# EAGLE design V2_Layout (EAGLE 9.2.2)
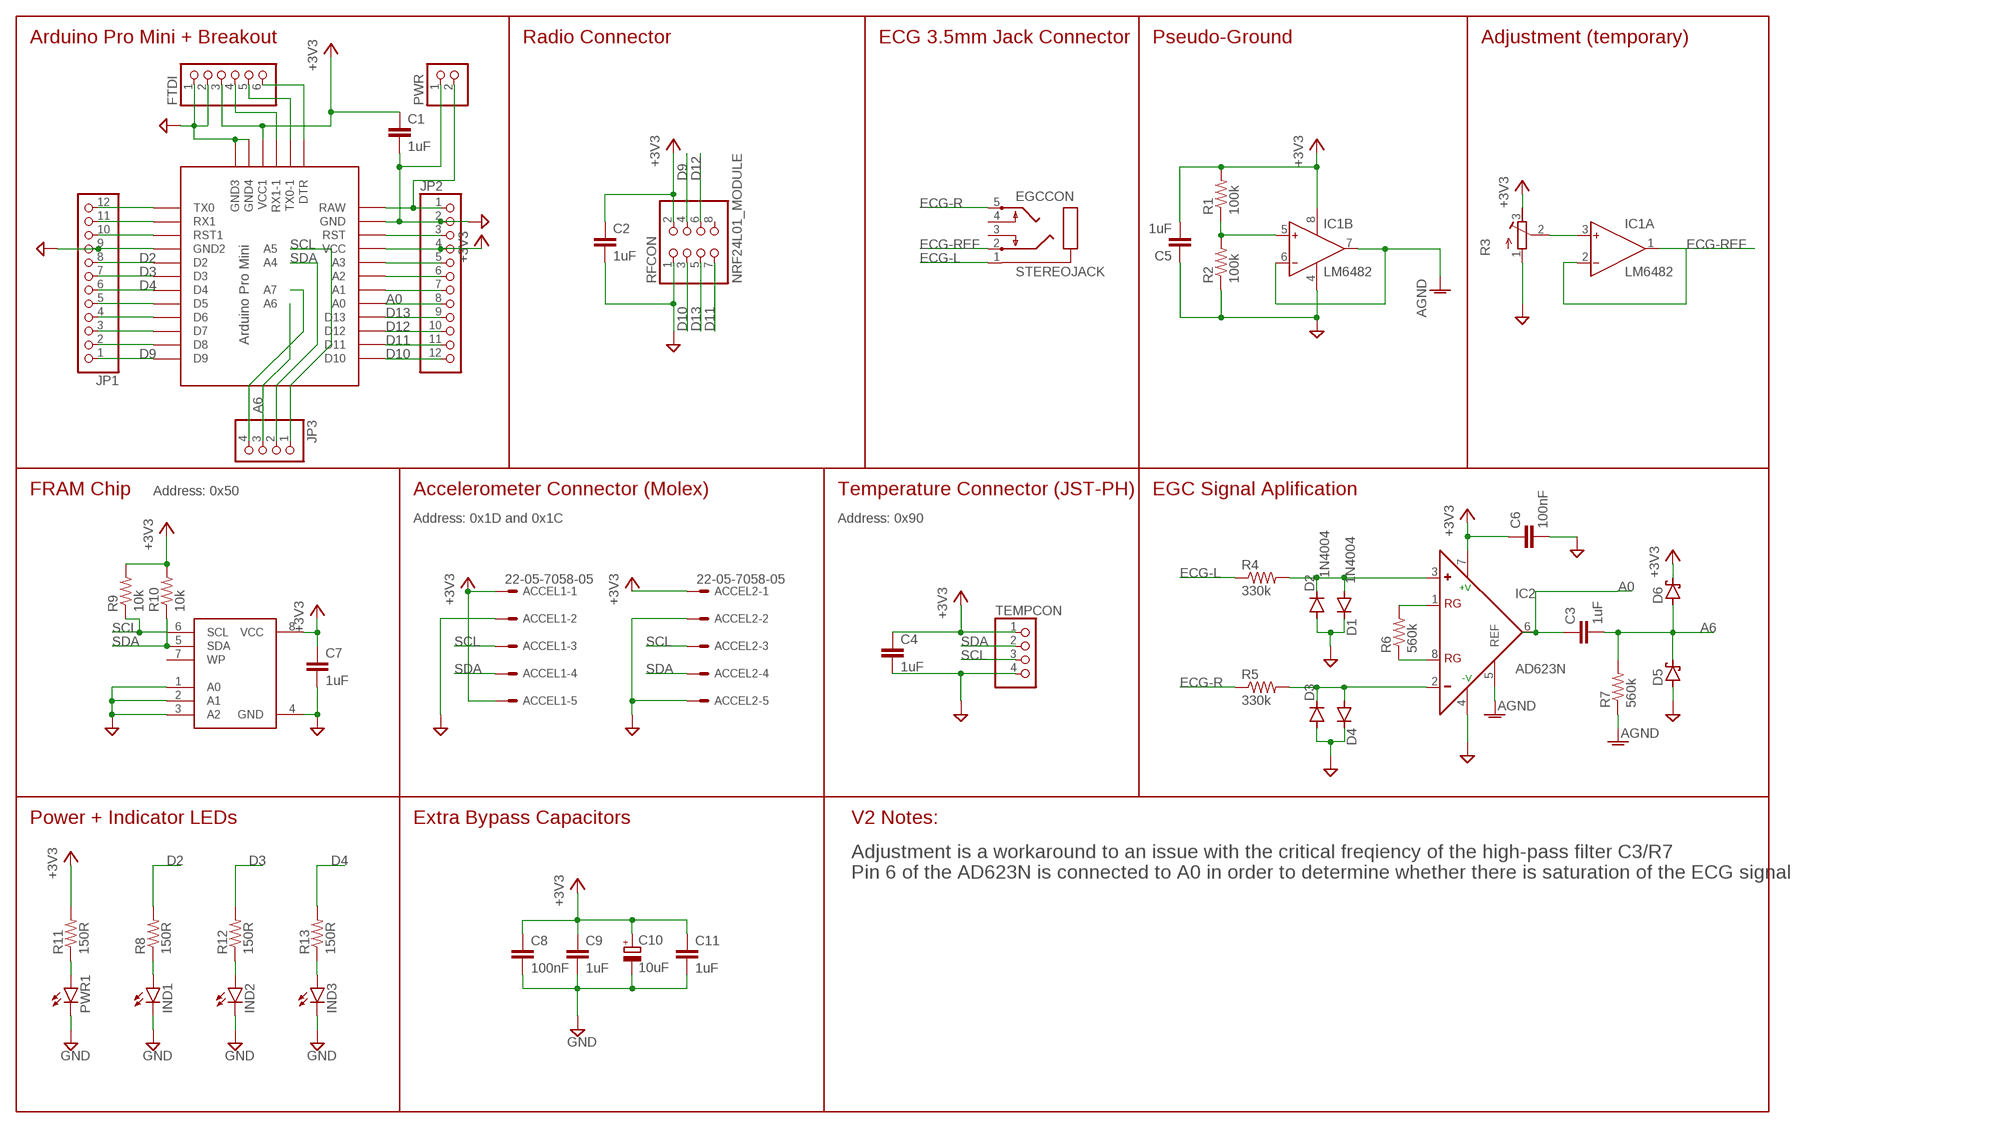
[diagram p0: schematic, sheet 1]

## Parts
ACCEL1  22-05-7058-05  [7395-05]
ACCEL2  22-05-7058-05  [7395-05]
C1  1uF  C-EUC0603  [C0603]
C2  1uF  C-EUC0603  [C0603]
C3  1uF  C-EUC0603  [C0603]
C4  1uF  C-EUC0603  [C0603]
C5  1uF  C-EUC0603  [C0603]
C6  100nF  C-EUC0603  [C0603]
C7  1uF  C-EUC0603  [C0603]
C8  100nF  C-EU025-030X050  [C025-030X050]
C9  1uF  C-EU025-030X050  [C025-030X050]
C10  10uF  CPOL-EUTAP5-45  [TAP5-45]
C11  1uF  C-EU025-030X050  [C025-030X050]
D1  1N4004  [DO41-10]
D2  1N4004  [DO41-10]
D3  1N4004  [DO41-10]
D4  1N4004  [DO41-10]
D5  SCHOTTKY-DIODEDO35-7  [DO35-7]
D6  SCHOTTKY-DIODEDO35-7  [DO35-7]
EGCCON  STEREOJACK  [STX3100]
FTDI  PINHD-1X6  [1X06]
IC1  LM6482  AD826N  [DIL08]
IC2  AD623N  [DIL08]
IND1  LEDCHIPLED_0805  [CHIPLED_0805]
IND2  LEDCHIPLED_0805  [CHIPLED_0805]
IND3  LEDCHIPLED_0805  [CHIPLED_0805]
JP1  PINHD-1X12  [1X12]
JP2  PINHD-1X12  [1X12]
JP3  PINHD-1X4  [1X04]
PWR  PINHD-1X2  [1X02]
PWR1  LEDCHIPLED_0805  [CHIPLED_0805]
R1  100k  R-US_R0603  [R0603]
R2  100k  R-US_R0603  [R0603]
R3  R-TRIMM64P  [RTRIM64P]
R4  330k  R-US_R0603  [R0603]
R5  330k  R-US_R0603  [R0603]
R6  560k  R-US_R0603  [R0603]
R7  560k  R-US_R0603  [R0603]
R8  150R  R-US_R0603  [R0603]
R9  10k  R-US_R0603  [R0603]
R10  10k  R-US_R0603  [R0603]
R11  150R  R-US_R0603  [R0603]
R12  150R  R-US_R0603  [R0603]
R13  150R  R-US_R0603  [R0603]
RFCON  NRF24L01_MODULE  [2X04]
TEMPCON  PINHD-1X4M  [1X04M]
U2  MB85RC256VPF-G-JNERE2  [SOIC8]
U$1  PRO-MINI-2  [PRO-MINI-2]

## Nets
+3V3 [POWER]: ACCEL1.1 ACCEL1.5 ACCEL2.1 C1.1 C2.1 C4.1 C5.2 C6.1 C7.1 C8.1 C9.1 C10.+ C11.1 D6.C FTDI.3 IC1.8(P:V+) IC2.7(+V) JP2.4 R1.2 R3.3(E) R9.2 R10.2 R11.2 RFCON.2 TEMPCON.1 U2.8(VCC) U$1.VCC U$1.VCC1
A0: C3.1 IC2.6(OUT) JP2.8 U$1.A3(A0)
A6: C3.2 D5.C D6.A JP3.3 R7.2 U$1.A6
AGND: IC1.6(B:IN-) IC1.7(B:OUT) IC2.5(REF) R7.1
D2: JP1.8 R8.2 U$1.D2
D3: JP1.7 R12.2 U$1.D3
D4: JP1.6 R13.2 U$1.D4
D5: JP1.5 U$1.D5
D6: JP1.4 U$1.D6
D7: JP1.3 U$1.D7
D8: JP1.2 U$1.D8
D9: JP1.1 RFCON.4 U$1.D9
D10: JP2.12 RFCON.3 U$1.D10
D11: JP2.11 RFCON.7 U$1.D11
D12: JP2.10 RFCON.6 U$1.D12
D13: JP2.9 RFCON.5 U$1.D13
ECG-L: EGCCON.1 R4.1
ECG-R: EGCCON.5 R5.1
ECG-REF: EGCCON.2 IC1.1(A:OUT) IC1.2(A:IN-)
GND [POWER]: ACCEL1.2 ACCEL2.2 ACCEL2.5 C1.2 C2.2 C4.2 C5.1 C6.2 C7.2 C8.2 C9.2 C10.- C11.2 D1.C D2.A D3.A D4.C D5.A FTDI.1 FTDI.2 IC1.4(P:V-) IC2.4(-V) IND1.C IND2.C IND3.C JP1.9 JP2.2 PWR1.C PWR.1 R2.1 R3.1(A) RFCON.1 TEMPCON.4 U2.1(A0) U2.2(A1) U2.3(A2) U2.4(GND) U$1.GND U$1.GND1(GND2) U$1.GND2(GND3) U$1.GND3(GND4)
N$1: PWR1.A R11.1
N$2: D3.C D4.A IC2.2(-) R5.2
N$3: IC1.5(B:IN+) R1.1 R2.2
N$4: FTDI.4 U$1.RX1-1
N$5: D1.A D2.C IC2.3(+) R4.2
N$7: IC2.8(RG) R6.1
N$8: IC2.1(RG) R6.2
N$9: JP1.12 U$1.TX0
N$10: JP1.11 U$1.RX1
N$11: JP1.10 U$1.RST1
N$12: FTDI.5 U$1.TX0-1
N$13: FTDI.6 U$1.DTR
N$14: IND1.A R8.1
N$15: IND2.A R12.1
N$16: IND3.A R13.1
N$17: IC1.3(A:IN+) R3.2(S)
N$21: JP2.1 PWR.2 U$1.RAW
N$23: JP2.3 U$1.RST
N$24: JP2.5 U$1.A0(A3)
N$25: JP2.6 U$1.A1(A2)
N$26: JP2.7 U$1.A2(A1)
N$28: JP3.4 U$1.A7
SCL: ACCEL1.3 ACCEL2.3 JP3.1 R9.1 TEMPCON.3 U2.6(SCL) U$1.A5
SDA: ACCEL1.4 ACCEL2.4 JP3.2 R10.1 TEMPCON.2 U2.5(SDA) U$1.A4
Unconnected: EGCCON.3 EGCCON.4 RFCON.8 U2.7(WP)

## Notes on the sheet
- Arduino Pro Mini + Breakout | Radio Connector | ECG 3.5mm Jack Connector | Pseudo-Ground | Adjustment (temporary)
- FRAM Chip | Address: 0x50 | Accelerometer Connector (Molex) | Temperature Connector (JST-PH) | EGC Signal Aplification
- Address: 0x1D and 0x1C | Address: 0x90
- Power + Indicator LEDs | Extra Bypass Capacitors | V2 Notes:
- Adjustment is a workaround to an issue with the critical freqiency of the high-pass filter C3/R7
  Pin 6 of the AD623N is connected to A0 in order to determine whether there is saturation of the ECG signal

## Library data of the parts
ACCEL1 ACCEL2 = con-molex:22-?-05: CONNECTOR wire to board 2.54 mm (.1 inch) pitch header; MF: MOLEX; OC_FARNELL: unknown; OC_NEWARK: unknown
C1-C9 C11 = rcl:C-EU: CAPACITOR, European symbol; SPICEPREFIX: C
C10 = rcl:CPOL-EU: POLARIZED CAPACITOR, European symbol; SPICEPREFIX: C
D1-D4 = diode:1N4004: DIODE general purpose rectifier, 1 A
D5 D6 = diode:SCHOTTKY-DIODE: Schottky Diode
EGCCON = adafruit:STEREOJACK: MIC/HEADPHONE JACK Stereo jack with two switches. Kycon STX3100, CUI SJ1-3555NG and/or 4UCon 05544
FTDI = pinhead:PINHD-1X6: PIN HEADER
IC1 = analog-devices:AD826: High-Speed, Low-Power Dual Operational Amplifier Source: http://www.analog.com/static/imported-files/data_sheets/AD826.pdf; MF: ALTERA CORPORATION; MPN: AD826ANZ; OC_FARNELL: 1438583; OC_NEWARK: 59K6530
IC2 = analog-devices:AD623: Single-Supply, Rail-to-Rail, Low Cost Instrumentation Amplifier Source: http://www.analog.com/static/imported-files/data_sheets/AD623.pdf; MF: ALTERA CORPORATION; MPN: AD623ANZ; OC_FARNELL: 9603700; OC_NEWARK: 59K4402
IND1-IND3 PWR1 = led:LED: LED OSRAM: - CHIPLED LG R971, LG N971, LY N971, LG Q971, LY Q971, LO R971, LY R971 LH N974, LH R974 LS Q976, LO Q976, LY Q976 LO Q996 - Hyper CHIPLED LW Q18S LB Q993, LB Q99A, LB R99A - SideLED LS A670, LO A670, LY A670, LG A670, LP A670 LB A673, LV A673, LT A673, LW A673 LH A674 LY A675 LS A676, LA A676, LO A676, LY A676, LW A676 LS A679, LY A679, LG A679 - Hyper Micro SIDELED® LS Y876, LA Y876, LO Y876, LY Y876 LT Y87S - SmartLED LW L88C, LW L88S LB L89C, LB L89S, LG L890 LS L89K, LO L89K, LY L89K LS L896, LA L896, LO L896, LY L896 - TOPLED LS T670, LO T670, LY T670, LG T670, LP T670 LSG T670, LSP T670, LSY T670, LOP T670, LYG T670 LG T671, LOG T671, LSG T671 LB T673, LV T673, LT T673, LW T673 LH T674 LS T676, LA T676, LO T676, LY T676, LB T676, LH T676, LSB T676, LW T676 LB T67C, LV T67C, LT T67C, LS T67K, LO T67K, LY T67K, LW E67C LS E67B, LA E67B, LO E67B, LY E67B, LB E67C, LV E67C, LT E67C LW T67C LS T679, LY T679, LG T679 LS T770, LO T770, LY T770, LG T770, LP T770 LB T773, LV T773, LT T773, LW T773 LH T774 LS E675, LA E675, LY E675, LS T675 LS T776, LA T776, LO T776, LY T776, LB T776 LHGB T686 LT T68C, LB T68C - Hyper Mini TOPLED® LB M676 - Mini TOPLED Santana® LG M470 LS M47K, LO M47K, LY M47K Source: http://www.osram.convergy.de LUXEON: - LUMILED® LXK2-PW12-R00, LXK2-PW12-S00, LXK2-PW14-U00, LXK2-PW14-V00 LXK2-PM12-R00, LXK2-PM12-S00, LXK2-PM14-U00 LXK2-PE12-Q00, LXK2-PE12-R00, LXK2-PE12-S00, LXK2-PE14-T00, LXK2-PE14-U00 LXK2-PB12-K00, LXK2-PB12-L00, LXK2-PB12-M00, LXK2-PB14-N00, LXK2-PB14-P00, LXK2-PB14-Q00 LXK2-PR12-L00, LXK2-PR12-M00, LXK2-PR14-Q00, LXK2-PR14-R00 LXK2-PD12-Q00, LXK2-PD12-R00, LXK2-PD12-S00 LXK2-PH12-R00, LXK2-PH12-S00 LXK2-PL12-P00, LXK2-PL12-Q00, LXK2-PL12-R00 Source: www.luxeon.com KINGBRIGHT: KA-3528ASYC Source: www.kingbright.com
JP1 JP2 = pinhead:PINHD-1X12: PIN HEADER
JP3 = pinhead:PINHD-1X4: PIN HEADER
PWR = pinhead:PINHD-1X2: PIN HEADER
R1 R2 R4-R13 = rcl:R-US_: RESISTOR, American symbol; SPICEPREFIX: R
R3 = rcl:R-TRIMM: Trimm resistor; SPICEMODEL: X; SPICEPREFIXL: POT
RFCON = Custom Parts:NRF24L01_MODULE
TEMPCON = pinhead2:PINHD-1X4: PIN HEADER
U2 = Custom Parts:MB85RC256VPF-G-JNERE2
U$1 = Arduino-clone:PRO-MINI-2: Arduino Pro Mini Layout 2 Sparkfun.com

## Net classes
0 default: width 0.406 mm
1 POWER: width 0.61 mm

## Board
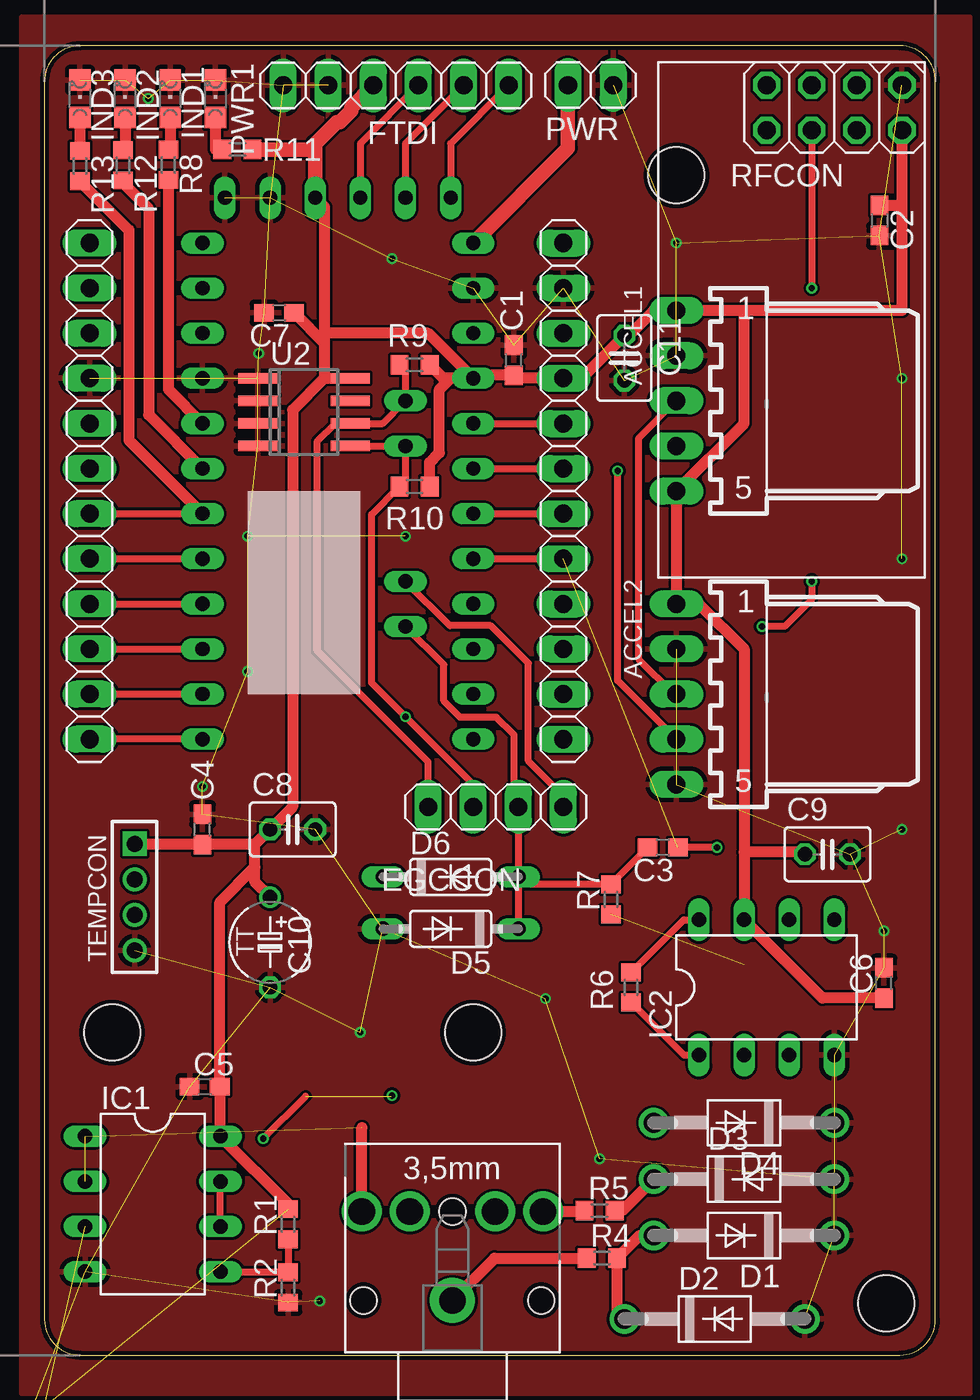
[diagram p1: board, top side]
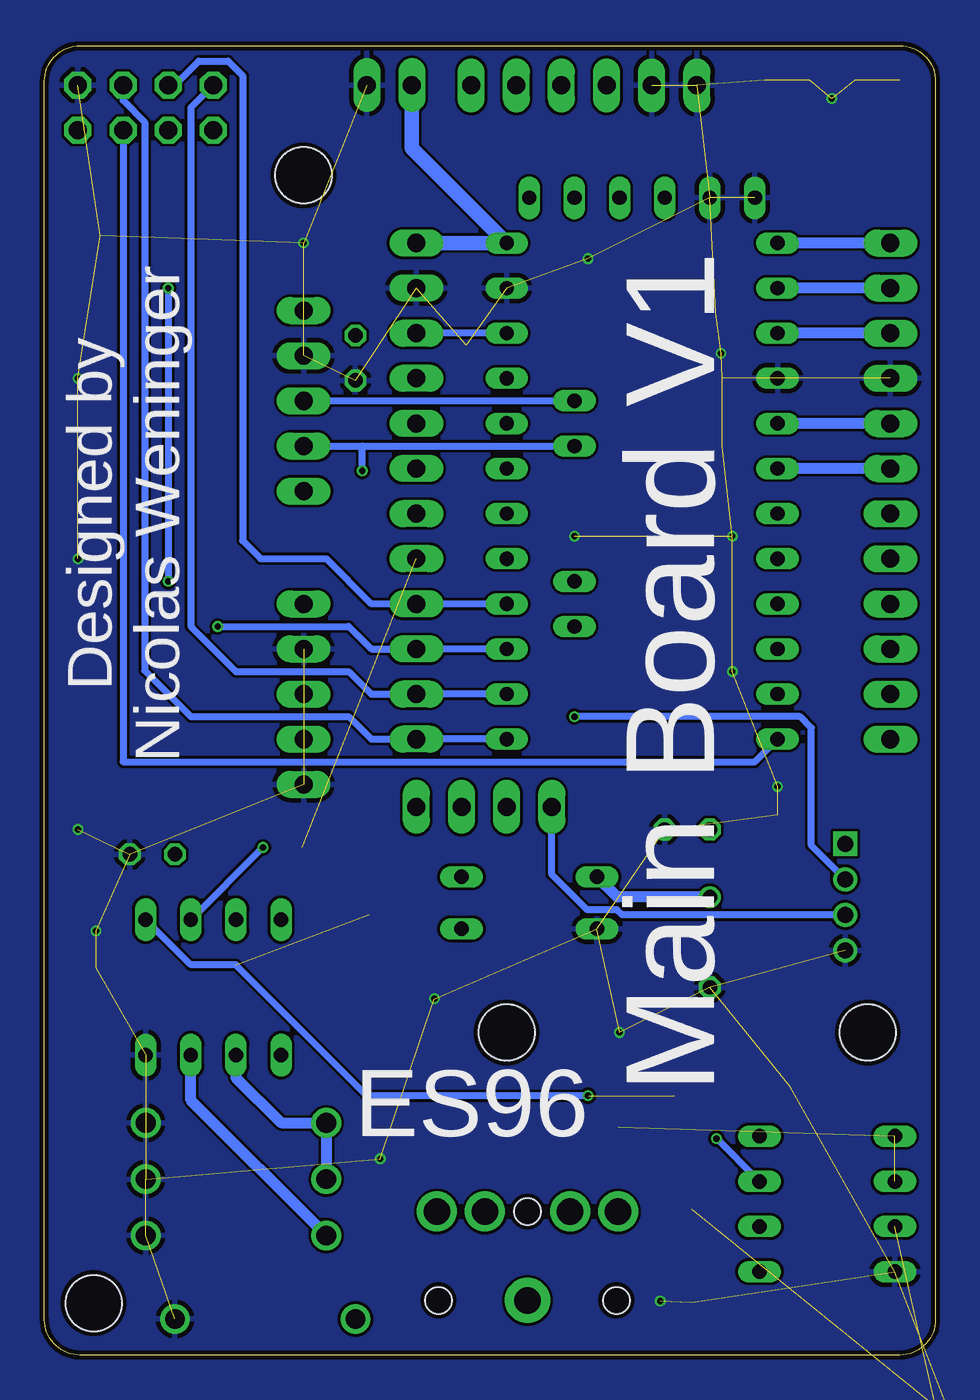
[diagram p2: board, bottom side, seen from below]

Size 50.14 x 73.71 mm. Coordinates in mm from the lower left corner, seen from the top.
Outline: 0,71.71 0,2 arc90 2,0 48.14,0 arc90 50.14,2 50.14,71.71 arc90 48.14,73.71 2,73.71 arc90 0,71.71
Copper layers (1*16): Top 0.035559375mm / dielectric 1.6mm / Bottom 0.035559375mm
Design rules "Custom": minimum track width 6mil, minimum drill 10mil, track to track 6mil, track to pad 6mil, pad to pad 6mil, via to via 6mil, smd to smd 6mil, copper to edge 10mil, drill to drill 6mil, minimum pad ring 5mil, minimum via ring 5mil, stop-mask expansion 2.5mil, vias tented up to drill 15mil, thermal gap 10mil
Holes 3.17 mm at 24.13,18.16 3.81,18.16 35.56,66.42 47.37,2.92

### Footprints (pad centres in the part's own frame; a part is rotated, then mirrored left to right if it is on the bottom)
7395-05 = drill 1.016 long: 1 5.08,0; 2 2.54,0; 3 0,0; 4 -2.54,0; 5 -5.08,0
C0603 = smd 1.1 x 1: 1 -0.85,0; 2 0.85,0
C025-030X050 = drill 0.813 octagon: 1 -1.27,0; 2 1.27,0
TAP5-45 = drill 0.813: + -2.54,0 | drill 0.813 octagon: - 2.54,0
DO41-10 = drill 1.118: A 5.08,0; C -5.08,0
DO35-7 = drill 0.813 long: A 3.81,0; C -3.81,0
STX3100 = drill 1.5 pad 2.54: 1 2.7,-0.1 | drill 1.5: 2 7.7,5; 3 7.7,2.3; 4 7.7,-2.5; 5 7.7,-5.2 | hole 1.5: 2.7,4.9; 2.7,-5.1; 7.7,-0.1
1X06 = drill 1.016 long: 1 -6.35,0; 2 -3.81,0; 3 -1.27,0; 4 1.27,0; 5 3.81,0; 6 6.35,0
DIL08 = drill 0.813 long: 1 -3.81,-3.81; 2 -1.27,-3.81; 3 1.27,-3.81; 4 3.81,-3.81; 5 3.81,3.81; 6 1.27,3.81; 7 -1.27,3.81; 8 -3.81,3.81
CHIPLED_0805 = smd 1.2 x 1.2: A 0,-1.05; C 0,1.05
1X12 = drill 1.016 long: 1 -13.97,0; 2 -11.43,0; 3 -8.89,0; 4 -6.35,0; 5 -3.81,0; 6 -1.27,0; 7 1.27,0; 8 3.81,0; 9 6.35,0; 10 8.89,0; 11 11.43,0; 12 13.97,0
1X04 = drill 1.016 long: 1 -3.81,0; 2 -1.27,0; 3 1.27,0; 4 3.81,0
1X02 = drill 1.016 long: 1 -1.27,0; 2 1.27,0
R0603 = smd 1 x 1.1: 1 -0.85,0; 2 0.85,0
RTRIM64P = drill 0.61: 1 0,-2.54; 2 2.54,0; 3 0,2.54
2X04 = drill 1.016 octagon: 1 1.27,1.27; 2 1.27,3.81; 3 3.81,1.27; 4 3.81,3.81; 5 6.35,1.27; 6 6.35,3.81; 7 8.89,1.27; 8 8.89,3.81
1X04M = drill 0.914 square: 1 -3,0 | drill 0.914: 2 -1,0; 3 1,0; 4 3,0
SOIC8 = smd 0.6 x 2.2: 1 -1.905,-2.6; 2 -0.635,-2.6; 3 0.635,-2.6; 4 1.905,-2.6; 5 1.905,2.6; 6 0.635,2.6; 7 -0.635,2.6; 8 -1.905,2.6
PRO-MINI-2 = drill 0.8 long: A0 6.35,2.54; A1 6.35,0; A2 6.35,-2.54; A3 6.35,-5.08; A4 2.54,1.27; A5 2.54,3.81; A6 2.54,-8.89; A7 2.54,-6.35; D2 -8.89,2.54; D3 -8.89,0; D4 -8.89,-2.54; D5 -8.89,-5.08; D6 -8.89,-7.62; D7 -8.89,-10.16; D8 -8.89,-12.7; D9 -8.89,-15.24; D10 6.35,-15.24; D11 6.35,-12.7; D12 6.35,-10.16; D13 6.35,-7.62; DTR 5.08,15.24; GND 6.35,10.16; GND1 -8.89,5.08; GND2 -7.62,15.24; GND3 -5.08,15.24; RAW 6.35,12.7; RST 6.35,7.62; RST1 -8.89,7.62; RX1 -8.89,10.16; RX1-1 0,15.24; TX0 -8.89,12.7; TX0-1 2.54,15.24; VCC 6.35,5.08; VCC1 -2.54,15.24

### Placement (x,y rotation side)
ACCEL1  35.56,53.72 90 top
ACCEL2  35.56,37.21 90 top
C1  26.42,56.01 90 top
C2  46.99,63.88 270 top
C3  34.8,28.57 180 top
C4  8.89,29.59 90 top
C5  9.02,15.11 0 top
C6  47.24,20.95 90 top
C7  13.21,58.67 180 top
C8  13.97,29.59 0 top
C9  44.07,28.19 0 top
C10  12.7,23.24 270 top
C11  32.64,56.13 270 top
D1  39.37,6.73 180 top
D2  37.72,2.03 0 top
D3  39.37,9.91 0 top
D4  39.37,13.08 180 top
D5  22.86,24 180 top
D6  22.86,26.92 0 top
EGCCON  22.86,0.38 90 top
FTDI  19.78,71.48 0 top
IC1  6.1,8.51 270 top
IC2  40.64,20.7 0 top
IND1  7.08,70.73 0 top
IND2  4.54,70.73 0 top
IND3  2,70.73 0 top
JP1  2.54,48.64 90 top
JP2  29.21,48.64 270 top
JP3  25.4,30.86 0 top
PWR  30.73,71.5 180 top
PWR1  9.62,70.73 0 top
R1  13.72,7.37 90 top
R2  13.72,3.81 90 top
R3  -3.81,-8.51 0 top  (outside the outline)
R4  31.37,5.46 0 top
R5  31.24,8.13 0 top
R6  33.02,20.7 270 top
R7  31.88,25.65 90 top
R8  6.97,67.01 270 top
R9  20.83,55.75 0 top
R10  20.83,48.89 0 top
R11  10.86,67.87 0 top
R12  4.43,66.98 270 top
R13  2,66.94 270 top
RFCON  49.53,72.77 180 top
TEMPCON  5.08,25.78 270 top
U2  14.6,53.09 270 top
U$1  17.78,49.91 0 top

### Tracks (layer width: path | path; a pad name or v marks a point on that pad's centre or on a via)
+3V3  (1 unrouted)
  Top 0.61: U$1.VCC1 15.75,64.64 15.75,57.53 | 15.75,57.53 15.75,56.98 | 15.75,54.99 U2.8 | U$1.VCC 24.3,55.16 C1.1 26.58,54.99 JP2.4 30.23,54.99 C11.1 32.89,57.4 34.29,58.8 ACCEL1.1 39.37,58.8 | U$1.VCC 22.86,54.99 | 22.86,54.99 22.44,54.99 R9.2 | R10.2 21.68,50.25 22.22,50.8 22.22,54.36 22.86,54.99 | RFCON.2 48.26,64.73 | 48.26,64.73 48.26,58.8 39.37,58.8 | C2.1 48.26,64.73 | 39.37,58.8 39.37,52.45 ACCEL1.5 ACCEL2.1 36.83,42.29 39.37,39.75 39.37,28.32 | 15.75,54.99 13.97,53.21 13.97,30.86 C8.1 11.85,28.74 | 11.85,28.74 C4.1 5.12,28.74 TEMPCON.1 | C10.+ 11.85,26.63 11.85,27.47 | 39.37,28.32 IC2.7 43.78,20.1 C6.1 | C9.1 42.67,28.32 39.37,28.32 | U$1.VCC 21.59,57.53 15.75,57.53 | 11.85,27.47 11.85,28.74 | 11.85,27.47 9.87,25.49 C5.2 9.91,15.07 IC1.8 13.72,8.51 R1.2 | C7.1 15.75,56.98 | 15.75,56.98 15.75,54.99
  Top 0.813: 15.24,68.21 U$1.VCC1 | FTDI.3 17.26,70.23 17.26,70.05 16.63,69.42 16.45,69.42 15.24,68.21 | R11.2 14.9,67.87 15.24,68.21
  Bottom 0.61: C10.+ 17.91,25.78 D6.C
A0  (via drill 0.35)  (1 unrouted)
  Top 0.406: U$1.A3 JP2.8 | v37.85,28.57 C3.1
  Bottom 0.406: IC2.6 v37.85,28.57
A6
  Top 0.406: U$1.A6 22.47,38.87 22.47,36.83 23.4,35.9 25.44,35.9 26.42,34.92 26.42,31.11 JP3.3 D6.A | D6.A D5.C | D6.A 27.09,26.5 R7.2 C3.2
AGND  (via drill 0.35)  (2 unrouted)
  Top 0.406: IC1.6 IC1.7 | v12.32,12.19 14.69,14.57 | 19.52,14.57 v19.56,14.6
  Bottom 0.406: IC1.7 v12.32,12.19 | v19.56,14.6 32,14.6 39.37,21.97 41.91,21.97 IC2.5
D2
  Top 0.61: R8.2 6.97,54.37 U$1.D2
  Bottom 0.61: JP1.8 U$1.D2
D3
  Top 0.61: R12.2 4.43,65.97 5.87,64.54 5.87,52.93 U$1.D3
  Bottom 0.61: JP1.7 U$1.D3
D4
  Top 0.406: JP1.6 U$1.D4
  Top 0.61: R13.2 4.75,63.34 4.75,51.51 U$1.D4
D5
  Top 0.406: JP1.5 U$1.D5
D6
  Top 0.406: JP1.4 U$1.D6
D7
  Top 0.406: JP1.3 U$1.D7
D8
  Top 0.406: JP1.2 U$1.D8
D9
  Top 0.406: U$1.D9 JP1.1
  Bottom 0.406: RFCON.4 45.72,33.4 10.16,33.4 U$1.D9
D10
  Bottom 0.406: RFCON.3 45.72,70.63 44.5,69.41 44.5,38.53 41.91,35.94 33.02,35.94 31.75,34.67 JP2.12 U$1.D10
D11
  Bottom 0.406: RFCON.7 41.91,70.23 41.91,41.02 39.37,38.48 33.02,38.48 31.75,37.21 30.48,37.21 JP2.11 U$1.D11
D12  (via drill 0.35)
  Top 0.406: RFCON.6 v43.18,60.07 | v43.18,43.56 43.18,42.55 41.66,41.02 v40.39,41.02
  Bottom 0.406: v43.18,60.07 v43.18,43.56 | v40.39,41.02 33.02,41.02 31.75,39.75 JP2.10 U$1.D12
D13
  Bottom 0.406: RFCON.5 42.82,71.5 41.47,72.85 39.81,72.85 38.99,72.03 38.99,45.85 37.97,44.83 34.29,44.83 31.75,42.29 JP2.9 U$1.D13
ECG-L
  Top 0.61: EGCCON.1 25.34,5.46 R4.1
ECG-R
  Top 0.61: EGCCON.5 30.34,8.08 R5.1
ECG-REF  (2 unrouted)
  Top 0.61: EGCCON.2 17.86,12.82
GND  (via drill 0.35)  (56 unrouted)
  other vias: 35.56,62.61 17.78,18.16 11.43,38.48 11.43,46.1 5.84,70.74 31.24,11.05 47.24,23.88 12.06,56.39 8.89,32 15.49,3.05 48.26,54.99 48.26,44.83 48.26,29.59 28.19,20.07 20.32,46.1 19.56,61.72
  pour Top: -1.27,75.31 -1.27,-2.16 3.81,-2.16 52.07,-2.16 52.07,71.5 52.07,75.31
  pour Bottom: -2.54,76.58 -2.54,-3.43 53.34,-3.43 53.34,76.58
N$1
  Top 0.61: PWR1.A 9.62,67.87 R11.1
N$2
  Top 0.61: R5.2 32.51,8.13 D3.C
  Bottom 0.61: D3.C D4.A 36.83,13.08 39.37,15.62 IC2.2
N$3
  Top 0.406: IC1.5 13.68,4.7 R2.2 R1.1
N$4
  Top 0.406: FTDI.4 17.78,68.21 U$1.RX1-1
N$5
  Top 0.61: D2.C 32.22,2.45 R4.2 33.49,6.73 D1.A
  Bottom 0.61: D1.A 41.91,14.35 IC2.3
N$7
  Top 0.406: R6.1 35.98,24.51 IC2.8
N$8
  Top 0.406: R6.2 35.98,16.89 IC2.1
N$9
  Bottom 0.61: JP1.12 U$1.TX0
N$10
  Bottom 0.61: JP1.11 U$1.RX1
N$11
  Bottom 0.61: JP1.10 U$1.RST1
N$12
  Top 0.406: FTDI.5 20.32,68.21 U$1.TX0-1
N$13
  Top 0.406: FTDI.6 22.86,68.21 U$1.DTR
N$14
  Top 0.61: IND1.A 7.08,67.86 R8.1
N$15
  Top 0.61: IND2.A 4.54,67.83 R12.1
N$16
  Top 0.61: IND3.A R13.1
N$17  (1 unrouted)
N$21
  Top 0.813: U$1.RAW 29.46,67.95 PWR.2
  Bottom 0.813: PWR.2 29.46,67.95 U$1.RAW JP2.1
N$23
  Bottom 0.406: U$1.RST JP2.3
N$24
  Top 0.406: U$1.A0 JP2.5
N$25
  Top 0.406: U$1.A1 JP2.6
N$26
  Top 0.406: U$1.A2 JP2.7
N$28
  Top 0.406: U$1.A7 22.82,41.06 25.11,41.06 27.23,38.95 27.23,33.46 29.21,31.48 JP3.4
SCL
  Top 0.406: R9.1 20.32,55.41 U$1.A5 19.05,52.45 U2.6 16.35,52.45 15.37,51.46 15.37,39.62 21.59,33.4 JP3.1 | ACCEL2.3 35.41,37.21 33.45,39.17 33.45,51.63 35.54,53.72 ACCEL1.3
  Bottom 0.406: ACCEL1.3 U$1.A5 | TEMPCON.3 17.64,24.78 17.92,25.07 19.61,25.07 21.59,27.05 JP3.1
SDA  (via drill 0.35)
  Top 0.406: U2.5 U$1.A4 20.32,49.24 R10.1 18.41,47.33 18.41,37.85 v20.32,35.94 24.13,32.13 JP3.2 | ACCEL2.4 32.26,37.97 v32.26,49.78
  Bottom 0.406: ACCEL1.4 32.26,51.18 | 32.26,51.18 U$1.A4 | v32.26,49.78 32.26,51.18 | TEMPCON.2 6.98,28.69 6.98,35.31 7.62,35.94 v20.32,35.94

### Text on the board
bPlace: Main Board V1 | Designed by / Nicolas Weninger | ES96